# Altium schematic sheet Serial To Parallel Converter.SchDoc
size A; PART_NAME: epf10k50eqc208-3; Organization: Altium Limited; Address1: L3, 12a Rodborough Rd; Address2: Frenchs Forest; Address3: NSW; Address4: Australia 2086; DocumentNumber: 1; SheetNumber: 1; SheetTotal: 1
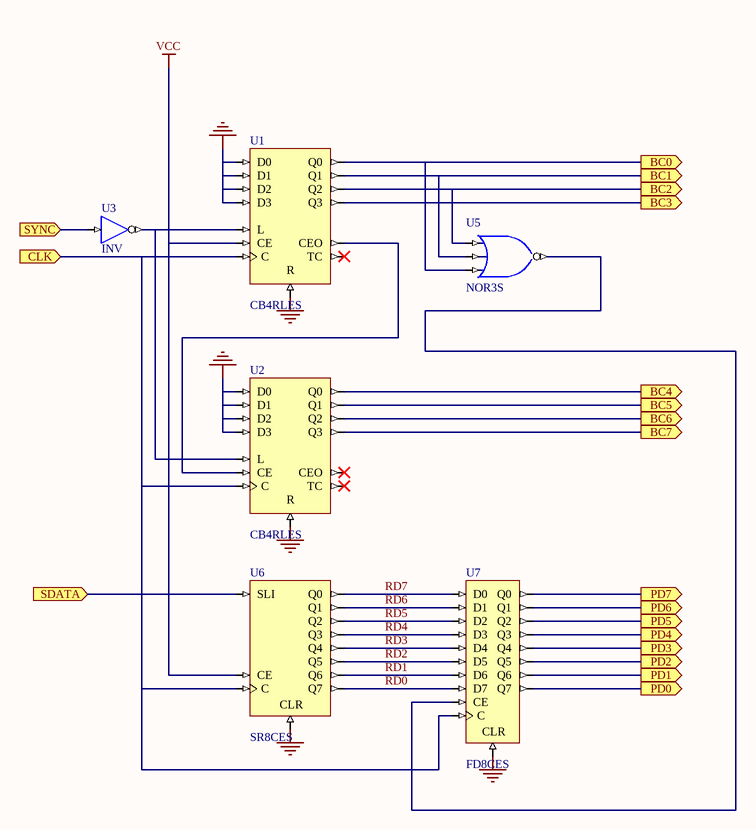
[diagram p0: Serial To Parallel Converter.SchDoc]

## Parts
U1  CB4RLES
U2  CB4RLES
U3  INV
U5  NOR3S
U6  SR8CES
U7  FD8CES

## Ports
BC0 (out), BC1 (out), BC2 (out), BC3 (out), BC4 (out), BC5 (out), BC6 (out), BC7 (out), CLK (in), PD0 (out), PD1 (out), PD2 (out), PD3 (out), PD4 (out), PD5 (out), PD6 (out), PD7 (out), SDATA (in), SYNC (in)

## Nets
GND: U1.D0 U1.D1 U1.D2 U1.D3 U1.R U2.D0 U2.D1 U2.D2 U2.D3 U2.R U6.CLR U7.CLR
VCC: U1.CE U6.CE
BC0: U1.Q0 U5.I2 ; port BC0
BC1: U1.Q1 U5.I1 ; port BC1
BC2: U1.Q2 U5.I0 ; port BC2
BC3: U1.Q3 ; port BC3
BC4: U2.Q0 ; port BC4
BC5: U2.Q1 ; port BC5
BC6: U2.Q2 ; port BC6
BC7: U2.Q3 ; port BC7
CLK: U1.C U2.C U6.C U7.C ; port CLK
PD0: U7.Q7 ; port PD0
PD1: U7.Q6 ; port PD1
PD2: U7.Q5 ; port PD2
PD3: U7.Q4 ; port PD3
PD4: U7.Q3 ; port PD4
PD5: U7.Q2 ; port PD5
PD6: U7.Q1 ; port PD6
PD7: U7.Q0 ; port PD7
RD0: U6.Q7 U7.D7
RD1: U6.Q6 U7.D6
RD2: U6.Q5 U7.D5
RD3: U6.Q4 U7.D4
RD4: U6.Q3 U7.D3
RD5: U6.Q2 U7.D2
RD6: U6.Q1 U7.D1
RD7: U6.Q0 U7.D0
SDATA: U6.SLI ; port SDATA
SYNC: U3.I ; port SYNC
NetU1_CEO: U1.CEO U2.CE
NetU1_L: U1.L U2.L U3.O
NetU5_O: U5.O U7.CE

Not connected (* = marked no-connect by the designer): U1 TC*; U2 CEO* TC*

## Notes on the sheet
- Title
- Size:
- Date:
- A
- Number:
- Time:
- Revision:
- Sheet
- of
- File:

## Library data of the parts
U1 U2 = CB4RLES: 4-Bit Loadable Cascadable Binary Counter with Clock Enable and Synchronous Reset, Single Pin Version; Xilinx Equivalent: CB4RLE; ArchiveName: GENERIC; VHDLIB_SIM: GENERIC_LIB; Published: 28-Jan-2004; Publisher: Altium Limited; Core Revision: 1.00.00
U3 = INV: Inverter; ArchiveName: GENERIC; VHDLIB_SIM: GENERIC_LIB; Published: 28-Jan-2004; Publisher: Altium Limited; Xilinx Equivalent: INV; Core Revision: 1.00.00
U5 = NOR3S: 3-Input NOR Gate, Single Pin Version; Xilinx Equivalent: NOR3; ArchiveName: GENERIC; VHDLIB_SIM: GENERIC_LIB; Published: 28-Jan-2004; Publisher: Altium Limited; Core Revision: 1.00.00
U6 = SR8CES: 8-Bit Serial-In Parallel-Out Shift Registers with Clock Enable and Asynchronous Clear, Single Pin  Version; ArchiveName: GENERIC; VHDLIB_SIM: GENERIC_LIB; Published: 28-Jan-2004; Publisher: Altium Limited; Core Revision: 1.00.00
U7 = FD8CES: 8-Bit D-Type Flip-Flop with Clock Enable and Asynchronous Clear, Single Pin Version; ArchiveName: GENERIC; VHDLIB_SIM: GENERIC_LIB; Published: 28-Jan-2004; Publisher: Altium Limited; Core Revision: 1.00.00